# EAGLE design Buffered 1GHz RF Probe SMA (EAGLE 5.12)
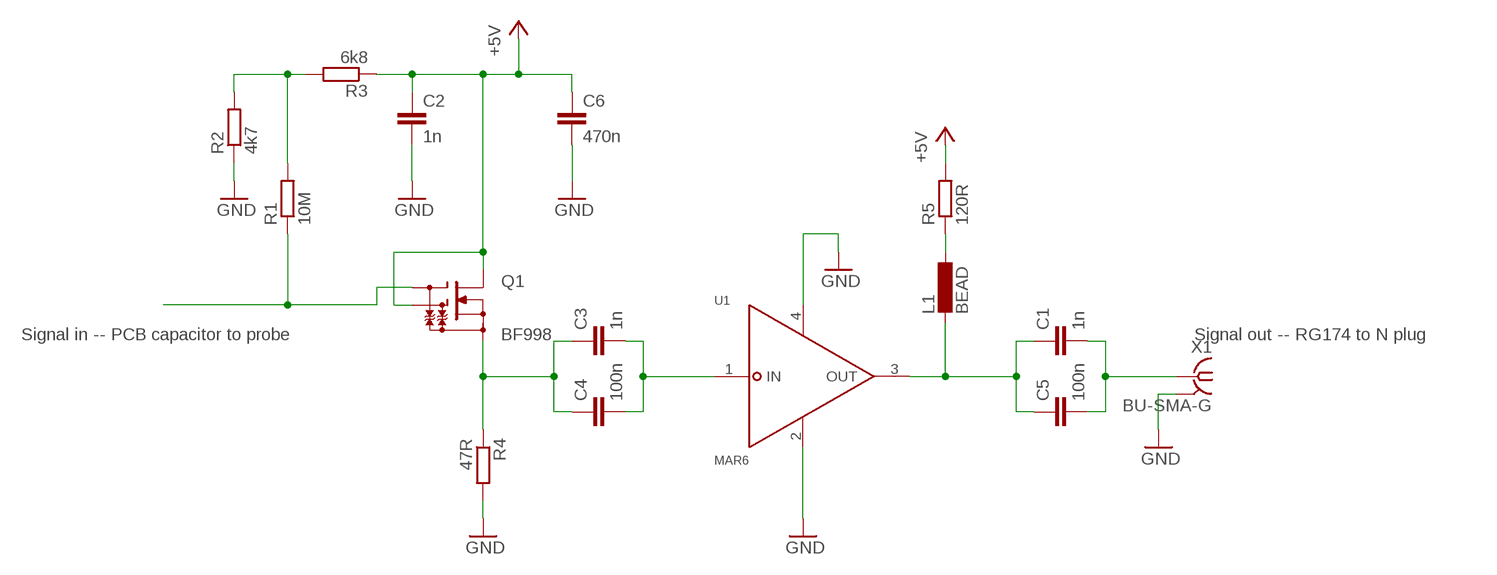
[diagram p0: schematic, sheet 1]

## Parts
C1  1n  C-EUC0805  [C0805]
C2  1n  C-EUC0805  [C0805]
C3  1n  C-EUC0805  [C0805]
C4  100n  C-EUC0805  [C0805]
C5  100n  C-EUC0805  [C0805]
C6  470n  C-EUC0805  [C0805]
L1  BEAD  L-EUL2012C  [L2012C]
Q1  BF998  [SOT143]
R1  10M  R-EU_R0805  [R0805]
R2  4k7  R-EU_R0805  [R0805]
R3  6k8  R-EU_R0805  [R0805]
R4  47R  R-EU_R0805  [R0805]
R5  120R  R-EU_R0805  [R0805]
U1  MAR6  MAR4SM  [MAR4SM]
X1  BU-SMA-G  [BU-SMA-G]

## Nets
+5V: C2.1 C6.1 Q1.2(DRAIN) Q1.3(G2) R3.1 R5.2
GND: C2.2 C6.2 R2.1 R4.2 U1.2 U1.4 X1.2(GND)
N$1: L1.1 R5.1
N$2: C3.1 C4.1 Q1.1(SOURCE) R4.1
N$3: R1.2 R2.2 R3.2
N$4: C1.1 C5.1 L1.2 U1.3(OUT)
SIGNAL_IN: Q1.4(G1) R1.1
SIGNAL_OUT: C1.2 C5.2 X1.1
SIGNAL_PRE: C3.2 C4.2 U1.1(IN)

## Notes on the sheet
- Signal in -- PCB capacitor to probe | Signal out -- RG174 to N plug

## Power pins joined to a net without a drawn wire
GND: X1.3(GND) X1.4(GND) X1.5(GND)

## Library data of the parts
C1-C6 = rcl:C-EU: CAPACITOR, European symbol
L1 = rcl:L-EU: INDUCTOR, European symbol
Q1 = RF_Probe:BF998: Silicon N-Channel Dual Gate MOSFET
R1-R5 = rcl:R-EU_: RESISTOR, European symbol
U1 = lasser:MAR4SM: Mini-Circuits MAR4SM Broadband Amplifier DC to 1GHz, 8dB Gain
X1 = con-coax:BU-SMA-G: FEMALE SMA CONNECTOR Radiall distributor RS 193-9117; OC_FARNELL: unknown; OC_NEWARK: unknown

## Board
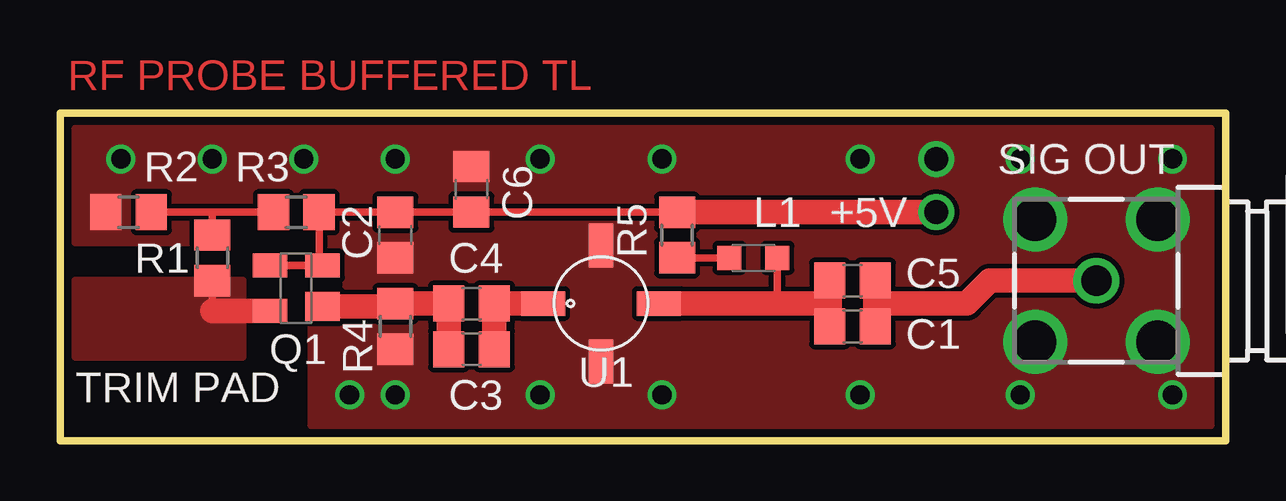
[diagram p1: board, top side]
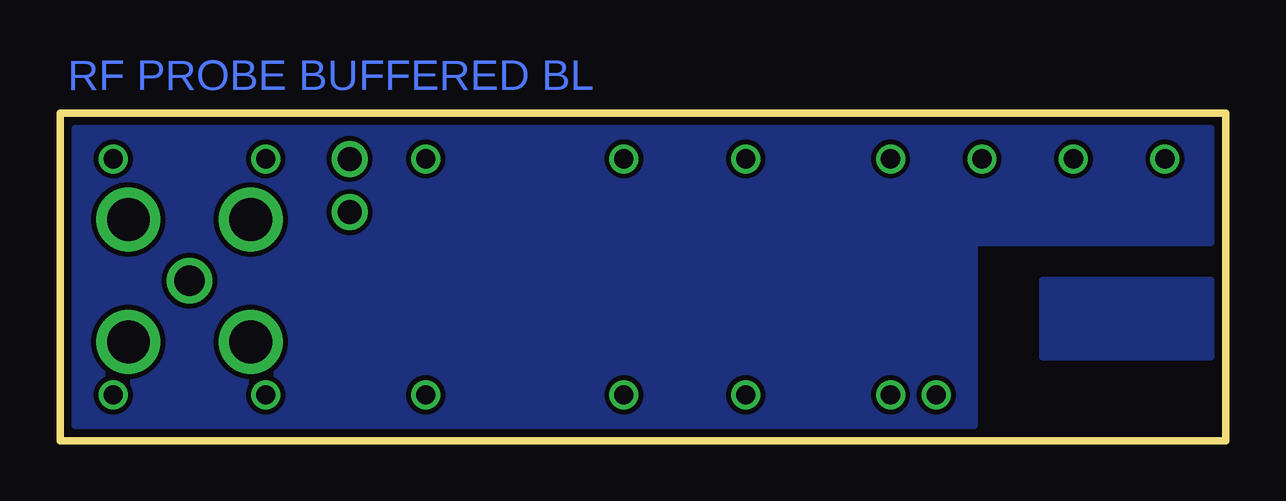
[diagram p2: board, bottom side, seen from below]

Size 48.58 x 13.65 mm. Coordinates in mm from the lower left corner, seen from the top.
Outline: 0,13.65 48.58,13.65 48.58,0 0,0 0,13.65
Copper layers (1*16): Top 0.035mm / dielectric 1.5mm / Bottom 0.035mm
Design rules "default *": minimum track width 10mil, minimum drill 24mil, track to track 8mil, track to pad 8mil, pad to pad 8mil, via to via 8mil, smd to smd 8mil, copper to edge 0mil, drill to drill 8mil, minimum pad ring 10mil, minimum via ring 8mil, stop-mask expansion 4mil, vias tented up to drill 0mil, thermal gap 10mil

### Footprints (pad centres in the part's own frame; a part is rotated, then mirrored left to right if it is on the bottom)
C0805 = smd 1.3 x 1.5: 1 -0.95,0; 2 0.95,0
L2012C = smd 1 x 1: 1 -1,0; 2 1,0
SOT143 = smd 1.2 x 1.44: 1 -0.75,-1.1 | smd 1 x 1.44: 2 0.95,-1.1; 3 0.95,1.1; 4 -0.95,1.1
R0805 = smd 1.3 x 1.5: 1 -0.95,0; 2 0.95,0
MAR4SM = smd 1.016 x 1.829: 1 0,-2.413; 3 0,2.413 | smd 1.829 x 1.016: 2 2.413,0; 4 -2.413,0
BU-SMA-G = drill 1.27 round: 1 0,0 | drill 1.778 round: 2 -2.55,2.55; 3 2.55,2.55; 4 2.55,-2.55; 5 -2.55,-2.55

### Placement (x,y rotation side)
C1  33.02,4.76 0 top
C2  13.97,8.57 270 top
C3  17.14,5.71 0 top
C4  17.14,3.81 0 top
C5  33.02,6.67 0 top
C6  17.14,10.48 90 top
L1  28.89,7.62 0 top
Q1  9.84,6.35 90 top
R1  6.35,7.62 90 top
R2  2.86,9.53 0 top
R3  9.84,9.53 180 top
R4  13.97,4.76 270 top
R5  25.72,8.57 90 top
U1  22.54,5.71 270 top
X1  43.18,6.67 0 top

### Tracks (layer width: path | path; a pad name or v marks a point on that pad's centre or on a via)
+5V  (via drill 1)
  Top 0.305: Q1.3 Q1.2 10.79,7.3 R3.1 C2.1 C6.1 R5.2
  Top 1.016: R5.2 27.3,9.52 27.94,9.53 v36.51,9.53
.
  pour Bottom (no thermals): 47.94,0.64 47.94,13.02 0.64,13.02 0.64,8.26 10.48,8.26 10.48,0.64
GND  (via drill 0.8, 1)
  other vias: 46.35,11.75 46.35,1.91 40.01,1.91 40.01,11.75 33.34,11.75 33.34,1.91 25.08,1.91 25.08,11.75 20,11.75 20,1.91 13.97,1.91 12.06,1.91 13.97,11.75 10.16,11.75 6.35,11.75 2.54,11.75 36.51,11.75
  pour Top (no thermals): 0.64,8.26 0.64,13.02 47.94,13.02 47.94,0.64 10.48,0.64 10.48,8.26
N$1
  Top 0.305: R5.1 L1.1
N$2
  Top 0.305: 13.97,5.6 R4.1 | C3.1
  Top 1.016: Q1.1 13.97,5.6 | R4.1 C3.1 | C3.1 C4.1
N$3
  Top 0.305: R2.2 6.35,9.53 | 6.35,9.53 R3.2 | 6.35,9.53 R1.2
N$4
  Top 0.305: L1.2 29.89,5.99 30.16,5.71
  Top 1.016: U1.3 30.16,5.71 32.07,5.71 | 32.07,5.71 C1.1 | 32.07,5.71 C5.1
SIGNAL_IN
  Top 0.305: R1.1 6.35,5.4 | Q1.4
  Top 1.016: 6.35,5.4 Q1.4
  pour Top (no thermals): 0.64,6.67 0.64,3.49 7.62,3.49 7.62,6.67
SIGNAL_OUT
  Top 1.016: C1.2 33.97,5.71 | 33.97,5.71 C5.2 | 33.97,5.71 37.78,5.71 38.73,6.67 X1.1
SIGNAL_PRE
  Top 1.016: C4.2 C3.2 U1.1
SIGNAL_PROBE
  pour Bottom: 7.62,3.49 7.62,6.67 0.64,6.67 0.64,3.49

### Text on the board
Top: RF PROBE BUFFERED TL
Bottom: RF PROBE BUFFERED BL
tPlace: SIG OUT | +5V | TRIM PAD